# Altium project Pannel3.5x2 Ver0.1.PrjPcb
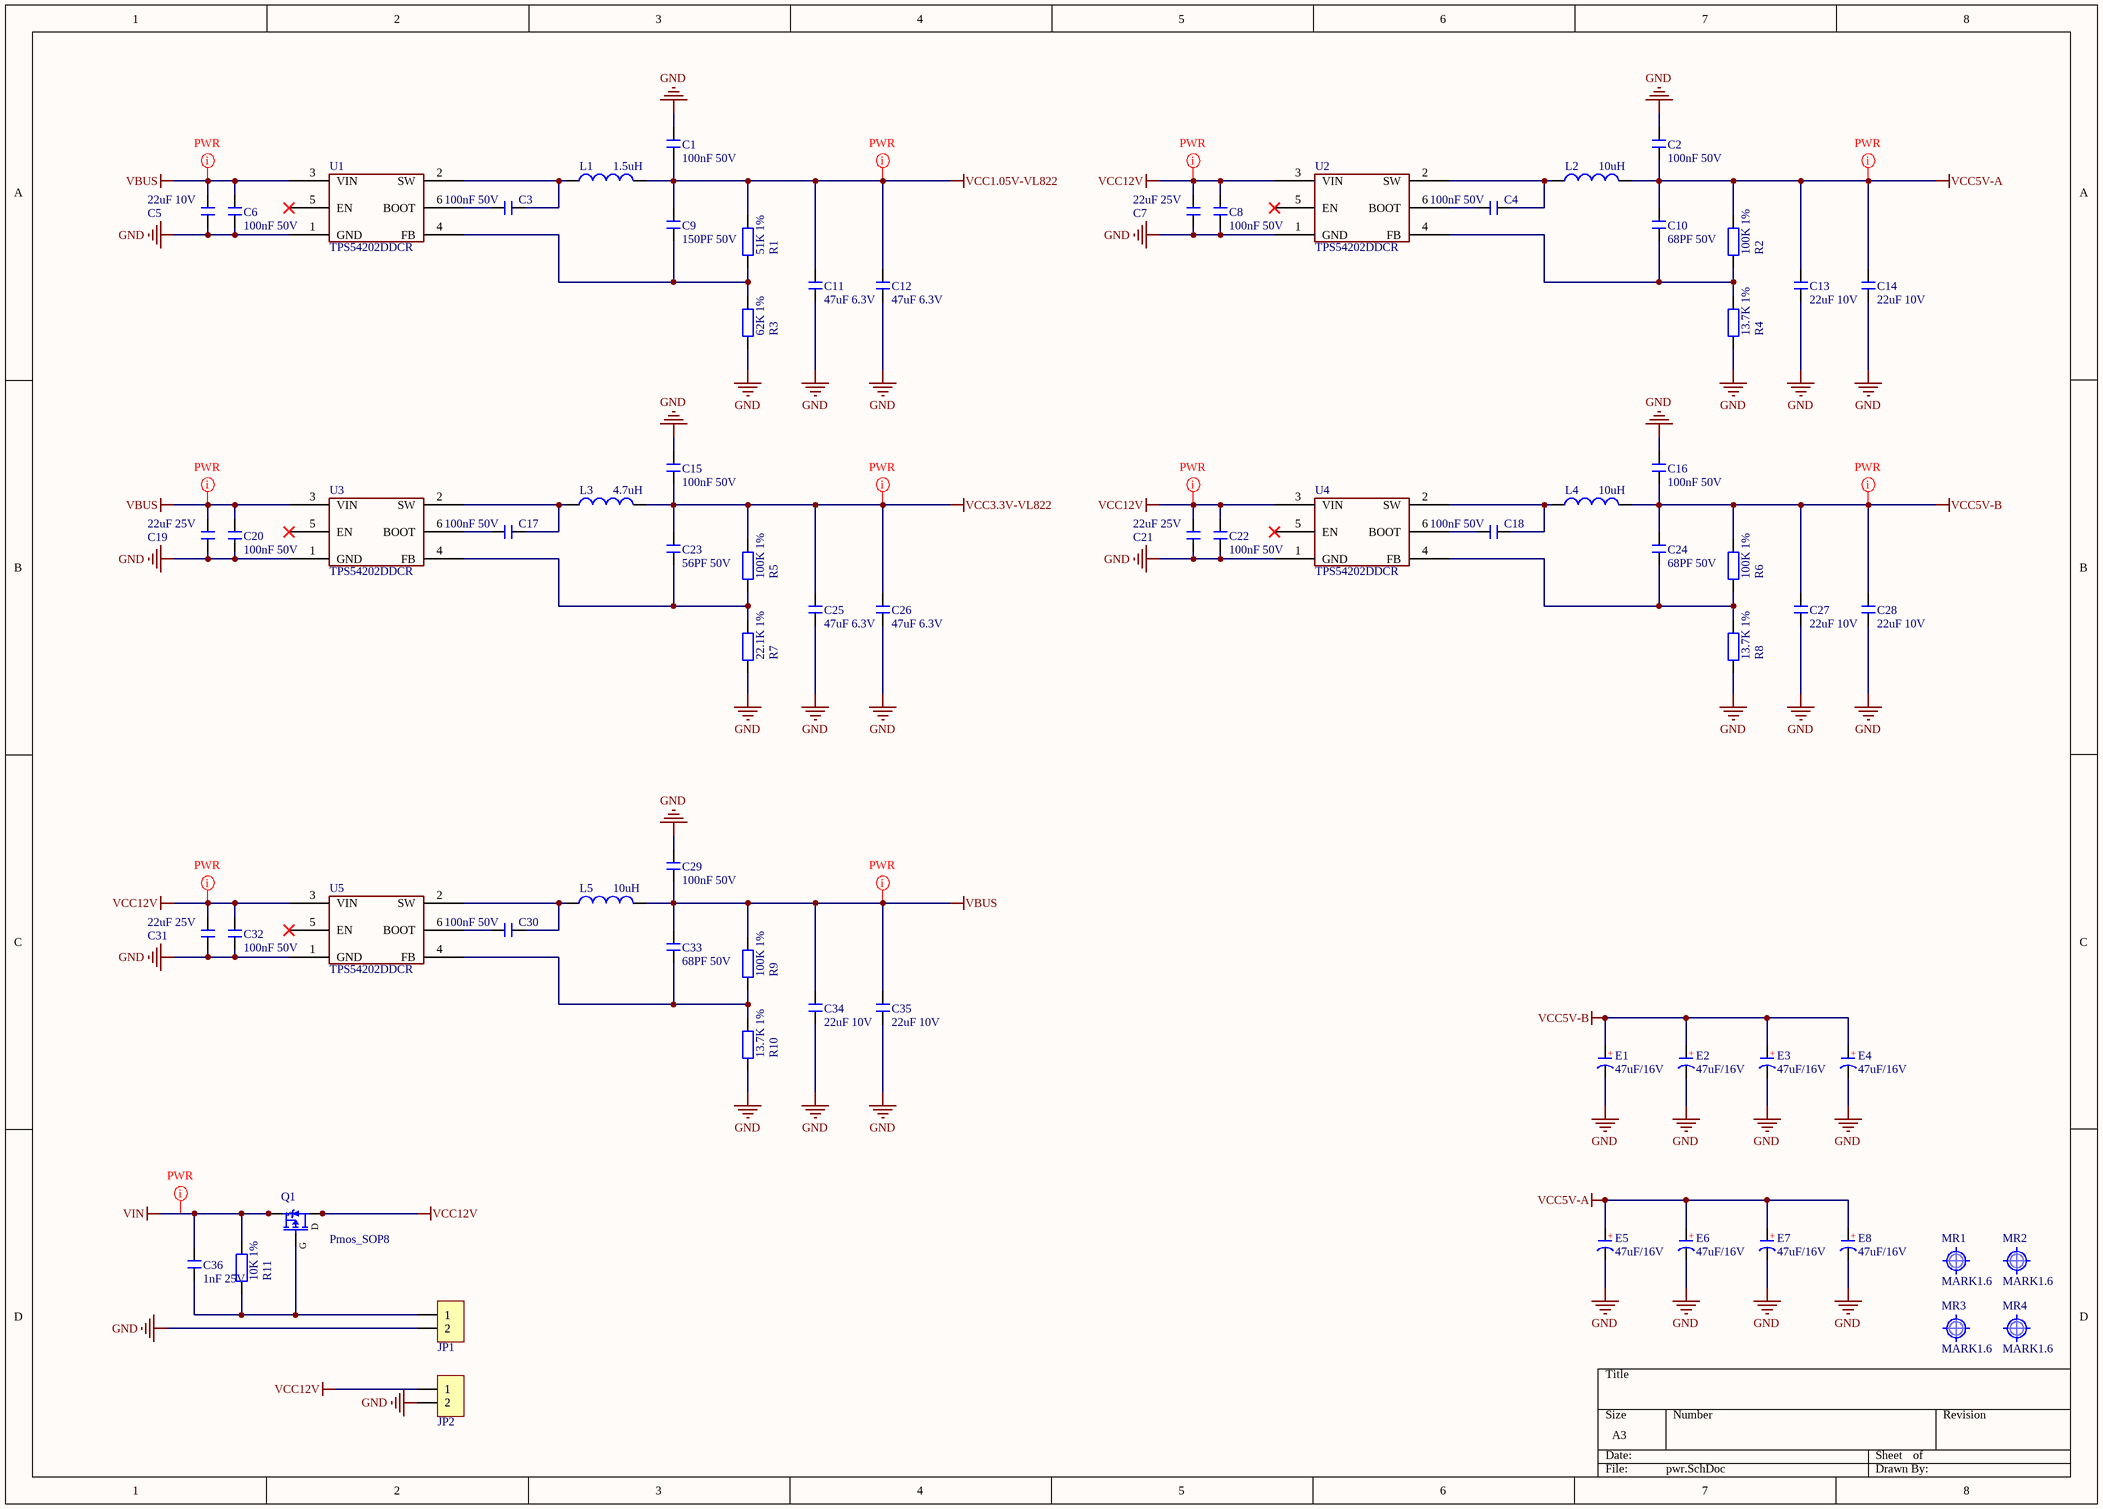
[diagram p0: pwr.SchDoc]
4 sheets, 216 parts. Net scope: global (net labels, ports and power ports of the same name join across sheets).
Board file: Pannel3.5x2 Ver0.1.PcbDoc
Sheets:
  pwr.SchDoc
  connector.SchDoc
  jmb575.SchDoc
  vl822.SchDoc

## Sheet pwr.SchDoc
size A3; SheetNumber: 1; SheetTotal: 4

### Parts
C1  100nF 50V  [C0402_L]
C2  100nF 50V  [C0402_L]
C3  100nF 50V  [C0402_L]
C4  100nF 50V  [C0402_L]
C5  22uF 10V  [C0805_L]
C6  100nF 50V  [C0402_L]
C7  22uF 25V  [C0805_L]
C8  100nF 50V  [C0402_L]
C9  150PF 50V  [C0402_L]
C10  68PF 50V  [C0402_L]
C11  47uF 6.3V  [C0805_L]
C12  47uF 6.3V  [C0805_L]
C13  22uF 10V  [C0805_L]
C14  22uF 10V  [C0805_L]
C15  100nF 50V  [C0402_L]
C16  100nF 50V  [C0402_L]
C17  100nF 50V  [C0402_L]
C18  100nF 50V  [C0402_L]
C19  22uF 25V  [C0805_L]
C20  100nF 50V  [C0402_L]
C21  22uF 25V  [C0805_L]
C22  100nF 50V  [C0402_L]
C23  56PF 50V  [C0402_L]
C24  68PF 50V  [C0402_L]
C25  47uF 6.3V  [C0805_L]
C26  47uF 6.3V  [C0805_L]
C27  22uF 10V  [C0805_L]
C28  22uF 10V  [C0805_L]
C29  100nF 50V  [C0402_L]
C30  100nF 50V  [C0402_L]
C31  22uF 25V  [C0805_L]
C32  100nF 50V  [C0402_L]
C33  68PF 50V  [C0402_L]
C34  22uF 10V  [C0805_L]
C35  22uF 10V  [C0805_L]
C36  1nF 25V  [C0402_L]
E1  47uF/16V  [CS 6*4 - R]
E2  47uF/16V  [CS 6*4 - R]
E3  47uF/16V  [CS 6*4 - R]
E4  47uF/16V  [CS 6*4 - R]
E5  47uF/16V  [CS 6*4 - R]
E6  47uF/16V  [CS 6*4 - R]
E7  47uF/16V  [CS 6*4 - R]
E8  47uF/16V  [CS 6*4 - R]
JP1  HDR-1X2  [ZH1.5-WS-2P]  (value not drawn)
JP2  HDR-1X2  [XH2.54-WS-2P]  (value not drawn)
L1  1.5uH  [SMMS0420]
L2  10uH  [SMMS0420]
L3  4.7uH  [SMMS0420]
L4  10uH  [SMMS0420]
L5  10uH  [SMMS0420]
MR1  MARK1.6  [Mark 1]
MR2  MARK1.6  [Mark 1]
MR3  MARK1.6  [Mark 1]
MR4  MARK1.6  [Mark 1]
Q1  Pmos_SOP8  [SOP8_L]
R1  51K 1%  [R0402_L]
R2  100K 1%  [R0402_L]
R3  62K 1%  [R0402_L]
R4  13.7K 1%  [R0402_L]
R5  100K 1%  [R0402_L]
R6  100K 1%  [R0402_L]
R7  22.1K 1%  [R0402_L]
R8  13.7K 1%  [R0402_L]
R9  100K 1%  [R0402_L]
R10  13.7K 1%  [R0402_L]
R11  10K 1%  [R0402_L]
U1  TPS54202DDCR  [SOT23-6L]
U2  TPS54202DDCR  [SOT23-6L]
U3  TPS54202DDCR  [SOT23-6L]
U4  TPS54202DDCR  [SOT23-6L]
U5  TPS54202DDCR  [SOT23-6L]

### Nets
GND: C1.2 C2.2 C5.1 C6.1 C7.1 C8.1 C11.2 C12.2 C13.2 C14.2 C15.2 C16.2 C19.1 C20.1 C21.1 C22.1 C25.2 C26.2 C27.2 C28.2 C29.2 C31.1 C32.1 C34.2 C35.2 E1.2(K) E2.2(K) E3.2(K) E4.2(K) E5.2(K) E6.2(K) E7.2(K) E8.2(K) JP1.2 JP2.2 R3.2 R4.2 R7.2 R8.2 R10.2 U1.1(GND) U2.1(GND) U3.1(GND) U4.1(GND) U5.1(GND)
VBUS: C5.2 C6.2 C19.2 C20.2 C29.1 C33.2 C34.1 C35.1 L5.2 R9.1 U1.3(VIN) U3.3(VIN)
VCC1.05V-VL822: C1.1 C9.2 C11.1 C12.1 L1.2 R1.1
VCC3.3V-VL822: C15.1 C23.2 C25.1 C26.1 L3.2 R5.1
VCC5V-A: C2.1 C10.2 C13.1 C14.1 E5.1(A) E6.1(A) E7.1(A) E8.1(A) L2.2 R2.1
VCC5V-B: C16.1 C24.2 C27.1 C28.1 E1.1(A) E2.1(A) E3.1(A) E4.1(A) L4.2 R6.1
VCC12V: C7.2 C8.2 C21.2 C22.2 C31.2 C32.2 JP2.1 Q1.5(D) Q1.6(D) Q1.7(D) Q1.8(D) U2.3(VIN) U4.3(VIN) U5.3(VIN)
VIN: C36.1 Q1.1(S) Q1.2(S) Q1.3(S) R11.1
NetC3_1: C3.1 U1.6(BOOT)
NetC3_2: C3.2 L1.1 U1.2(SW)
NetC4_1: C4.1 U2.6(BOOT)
NetC4_2: C4.2 L2.1 U2.2(SW)
NetC9_1: C9.1 R1.2 R3.1 U1.4(FB)
NetC10_1: C10.1 R2.2 R4.1 U2.4(FB)
NetC17_1: C17.1 U3.6(BOOT)
NetC17_2: C17.2 L3.1 U3.2(SW)
NetC18_1: C18.1 U4.6(BOOT)
NetC18_2: C18.2 L4.1 U4.2(SW)
NetC23_1: C23.1 R5.2 R7.1 U3.4(FB)
NetC24_1: C24.1 R6.2 R8.1 U4.4(FB)
NetC30_1: C30.1 U5.6(BOOT)
NetC30_2: C30.2 L5.1 U5.2(SW)
NetC33_1: C33.1 R9.2 R10.1 U5.4(FB)
NetC36_2: C36.2 JP1.1 Q1.4(G) R11.2

Not connected (* = marked no-connect by the designer): U1 5(EN)*; U2 5(EN)*; U3 5(EN)*; U4 5(EN)*; U5 5(EN)*

### Layout directives
net class PWR: VBUS, VCC1.05V-VL822, VCC3.3V-VL822, VCC5V-A, VCC5V-B, VCC12V, VIN

### Notes on the sheet
- (in symbol C-CD) +

### Library data of the parts
C1-C36 = C: 无极性贴片电容; 版权归属: 源创客; 材质: X7R; BOM名称: 无极性贴片电容; 学习资源: www.ooocke.com
E1-E8 = C-CD: 贴片电解电容; BOM名称: 贴片钽电容; 版权归属: 源创客; 学习资源: www.ooocke.com
JP1 JP2 = Header 2: 2P接插件; 版权归属: 源创客; BOM名称: 2P接插件; 学习资源: www.ooocke.com
L1-L5 = L: 小功率贴片电感; 版权归属: 源创客; BOM名称: 小功率贴片电感; 学习资源: www.ooocke.com
MR1-MR4 = MARK: 光学定位点; 版权归属: 源创客; BOM名称: 光学定位点; 学习资源: www.ooocke.com
Q1 = Pmos_SOP8: BOM名称: 场效应管; 版权归属: 源创客; 描述: P沟道 30V/4.2A; 学习资源: www.ooocke.com
R1-R11 = R: 贴片电阻; 版权归属: 源创客; BOM名称: 贴片电阻; 学习资源: www.ooocke.com
U1-U5 = TPS54202DDCR: DCDC Convert

## Sheet connector.SchDoc
size A4; SheetNumber: 2; SheetTotal: 4
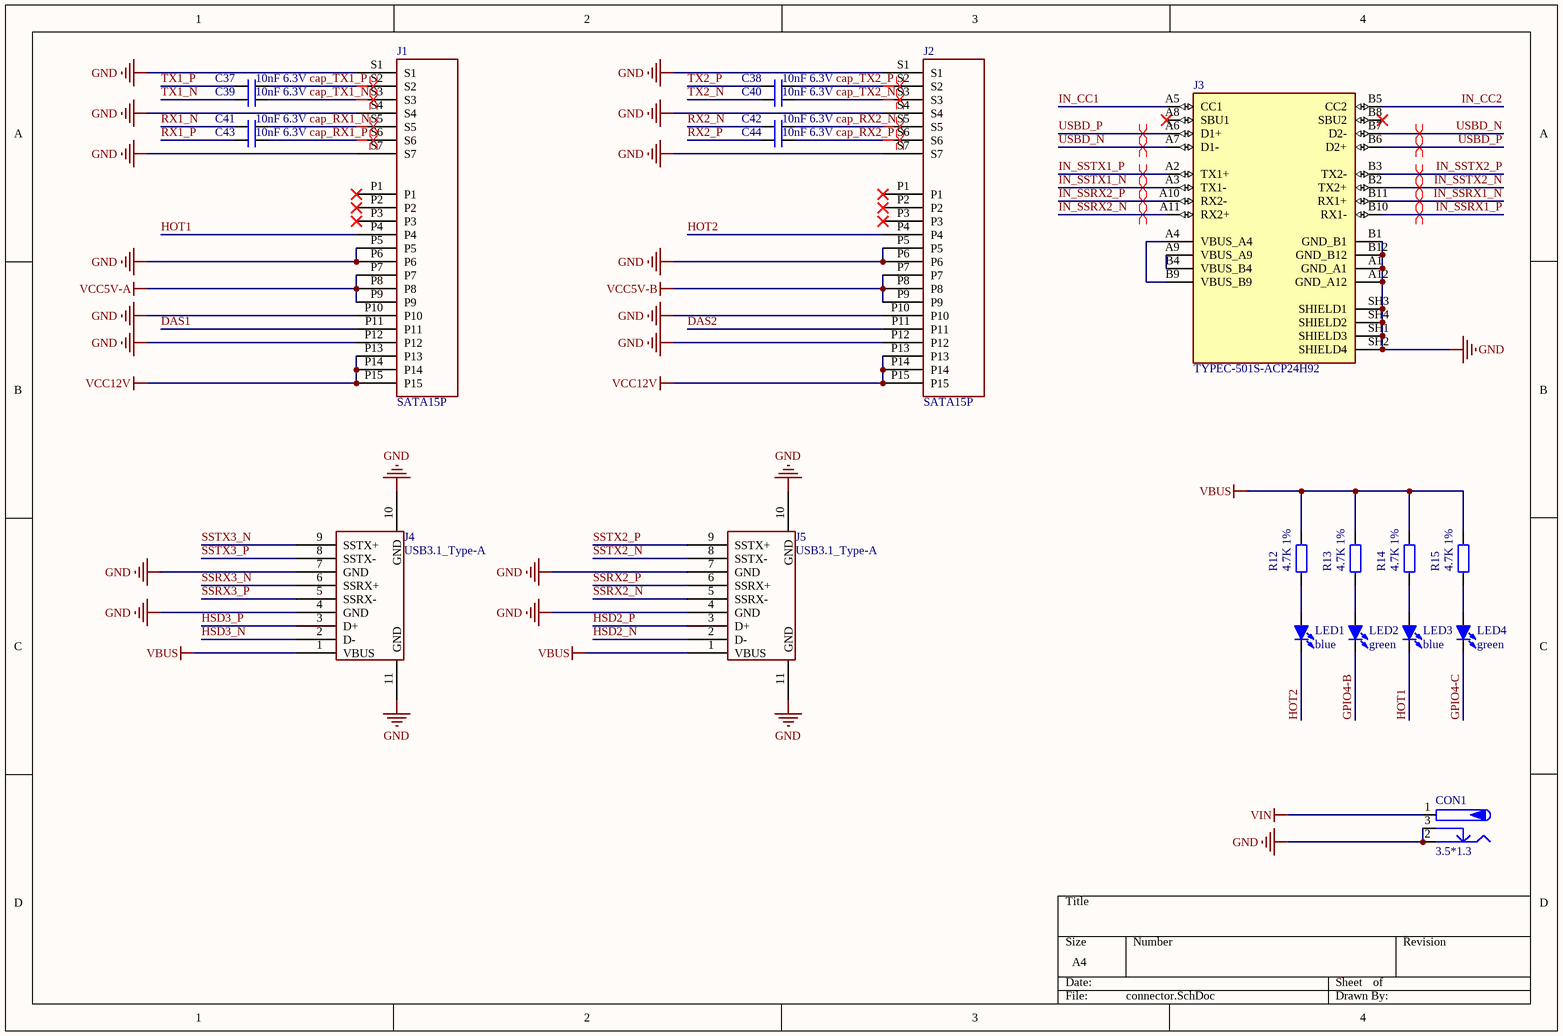
[diagram p1: connector.SchDoc]

### Parts
C37  10nF 6.3V  [C0402_L]
C38  10nF 6.3V  [C0402_L]
C39  10nF 6.3V  [C0402_L]
C40  10nF 6.3V  [C0402_L]
C41  10nF 6.3V  [C0402_L]
C42  10nF 6.3V  [C0402_L]
C43  10nF 6.3V  [C0402_L]
C44  10nF 6.3V  [C0402_L]
CON1  3.5*1.3  [DC-IN-SMD_DC-182-25A]
J1  SATA15P  [SATA 15P 贴片]
J2  SATA15P  [SATA 15P 贴片]
J3  TYPEC-501S-ACP24H92  [TypeC 24p 直立]
J4  USB3.1_Type-A  [USB3.1_Type-A 立式直插]
J5  USB3.1_Type-A  [USB3.1_Type-A 立式直插]
LED1  blue  [LED 0805B]
LED2  green  [LED 0805G]
LED3  blue  [LED 0805B]
LED4  green  [LED 0805G]
R12  4.7K 1%  [R0402_L]
R13  4.7K 1%  [R0402_L]
R14  4.7K 1%  [R0402_L]
R15  4.7K 1%  [R0402_L]

### Nets
GND: CON1.2 CON1.3 J1.P5 J1.P6 J1.P10 J1.P12 J1.S1 J1.S4 J1.S7 J2.P5 J2.P6 J2.P10 J2.P12 J2.S1 J2.S4 J2.S7 J3.A1(GND_A1) J3.A12(GND_A12) J3.B1(GND_B1) J3.B12(GND_B12) J3.SH1(SHIELD3) J3.SH2(SHIELD4) J3.SH3(SHIELD1) J3.SH4(SHIELD2) J4.4(GND) J4.7(GND) J4.10(GND) J4.11(GND) J5.4(GND) J5.7(GND) J5.10(GND) J5.11(GND)
VBUS: J4.1(VBUS) J5.1(VBUS) R12.1 R13.1 R14.1 R15.1
VCC5V-A: J1.P7 J1.P8 J1.P9
VCC5V-B: J2.P7 J2.P8 J2.P9
VCC12V: J1.P13 J1.P14 J1.P15 J2.P13 J2.P14 J2.P15
VIN: CON1.1
cap_RX1_N: C41.1 J1.S5
cap_RX1_P: C43.1 J1.S6
cap_RX2_N: C42.1 J2.S5
cap_RX2_P: C44.1 J2.S6
cap_TX1_N: C39.1 J1.S3
cap_TX1_P: C37.1 J1.S2
cap_TX2_N: C40.1 J2.S3
cap_TX2_P: C38.1 J2.S2
DAS1: J1.P11
DAS2: J2.P11
GPIO4-B: LED2.2(K)
GPIO4-C: LED4.2(K)
HOT1: J1.P4 LED3.2(K)
HOT2: J2.P4 LED1.2(K)
HSD2_N: J5.2(D-)
HSD2_P: J5.3(D+)
HSD3_N: J4.2(D-)
HSD3_P: J4.3(D+)
IN_CC1: J3.A5(CC1)
IN_CC2: J3.B5(CC2)
IN_SSRX1_N: J3.B11(RX1+)
IN_SSRX1_P: J3.B10(RX1-)
IN_SSRX2_N: J3.A11(RX2+)
IN_SSRX2_P: J3.A10(RX2-)
IN_SSTX1_N: J3.A3(TX1-)
IN_SSTX1_P: J3.A2(TX1+)
IN_SSTX2_N: J3.B2(TX2+)
IN_SSTX2_P: J3.B3(TX2-)
RX1_N: C41.2
RX1_P: C43.2
RX2_N: C42.2
RX2_P: C44.2
SSRX2_N: J5.5(SSRX-)
SSRX2_P: J5.6(SSRX+)
SSRX3_N: J4.6(SSRX+)
SSRX3_P: J4.5(SSRX-)
SSTX2_N: J5.8(SSTX-)
SSTX2_P: J5.9(SSTX+)
SSTX3_N: J4.9(SSTX+)
SSTX3_P: J4.8(SSTX-)
TX1_N: C39.2
TX1_P: C37.2
TX2_N: C40.2
TX2_P: C38.2
USBD_N: J3.A7(D1-) J3.B7(D2-)
USBD_P: J3.A6(D1+) J3.B6(D2+)
NetJ3_A4: J3.A4(VBUS_A4) J3.B9(VBUS_B9)
NetJ3_A9: J3.A9(VBUS_A9) J3.B4(VBUS_B4)
NetLED1_1: LED1.1(A) R12.2
NetLED2_1: LED2.1(A) R13.2
NetLED3_1: LED3.1(A) R14.2
NetLED4_1: LED4.1(A) R15.2

Not connected (* = marked no-connect by the designer): J1 P1* P2* P3*; J2 P1* P2* P3*; J3 A8(SBU1)* B8(SBU2)*

### Layout directives
differential pair: cap_RX1_N, cap_RX1_P, cap_RX2_N, cap_RX2_P, cap_TX1_N, cap_TX1_P, cap_TX2_N, cap_TX2_P, IN_SSRX1_N, IN_SSRX1_P, IN_SSRX2_N, IN_SSRX2_P, IN_SSTX1_N, IN_SSTX1_P, IN_SSTX2_N, IN_SSTX2_P, USBD_N, USBD_P

### Library data of the parts
C37-C44 = C: 无极性贴片电容; 版权归属: 源创客; 材质: X7R; BOM名称: 无极性贴片电容; 学习资源: www.ooocke.com
CON1 = P-DC: 低压电源接口; BOM名称: DC电源接口; 版权归属: 源创客; 学习资源: www.ooocke.com
J3 = Typec 24p: USB-C (USB TYPE-C) USB 3.2 Gen 2 (USB 3.1 Gen 2, Superspeed + (USB 3.1)) Receptacle Connector 24 Position Surface Mount, Right Angle; Through Hole; MF: Molex; MP: 1054500101; SnapEDA_Link: https://www.snapeda.com/parts/1054500101/Molex/view-part/?ref=snap; Package: None; Value: *; Check_prices: https://www.snapeda.com/parts/1054500101/Molex/view-part/?ref=eda
J4 J5 = USB3.1_Type-A: USB接口
LED1-LED4 = LED-3MM: 插件LED; 版权归属: 源创客; BOM名称: 插件LED; 学习资源: www.ooocke.com
R12-R15 = R: 贴片电阻; 版权归属: 源创客; BOM名称: 贴片电阻; 学习资源: www.ooocke.com

## Sheet jmb575.SchDoc
size A2; SheetNumber: 3; SheetTotal: 4
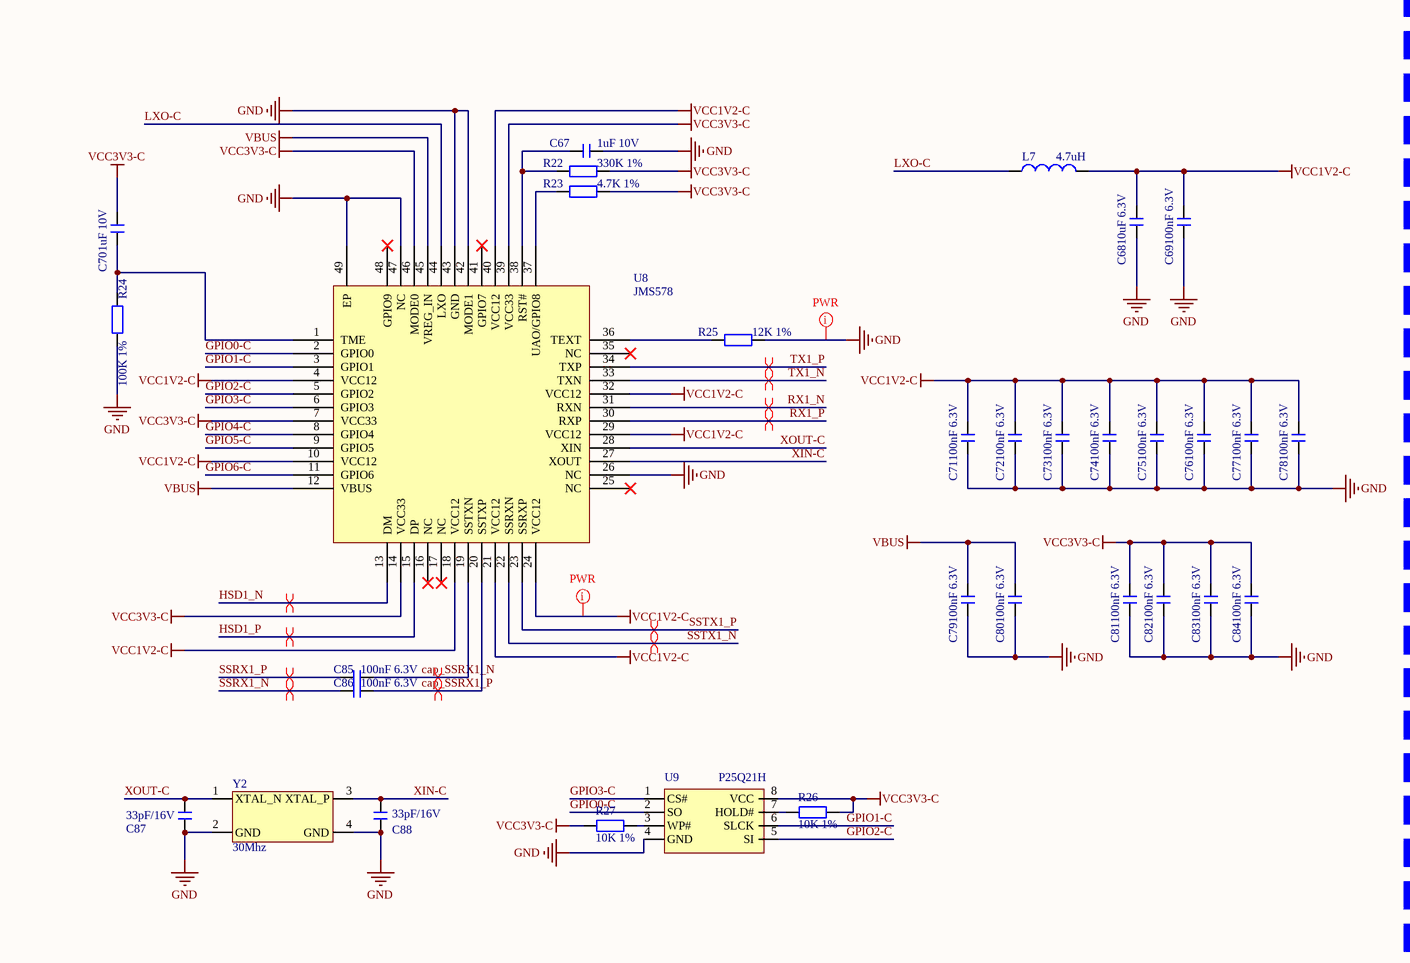
[diagram p2: jmb575.SchDoc, left]
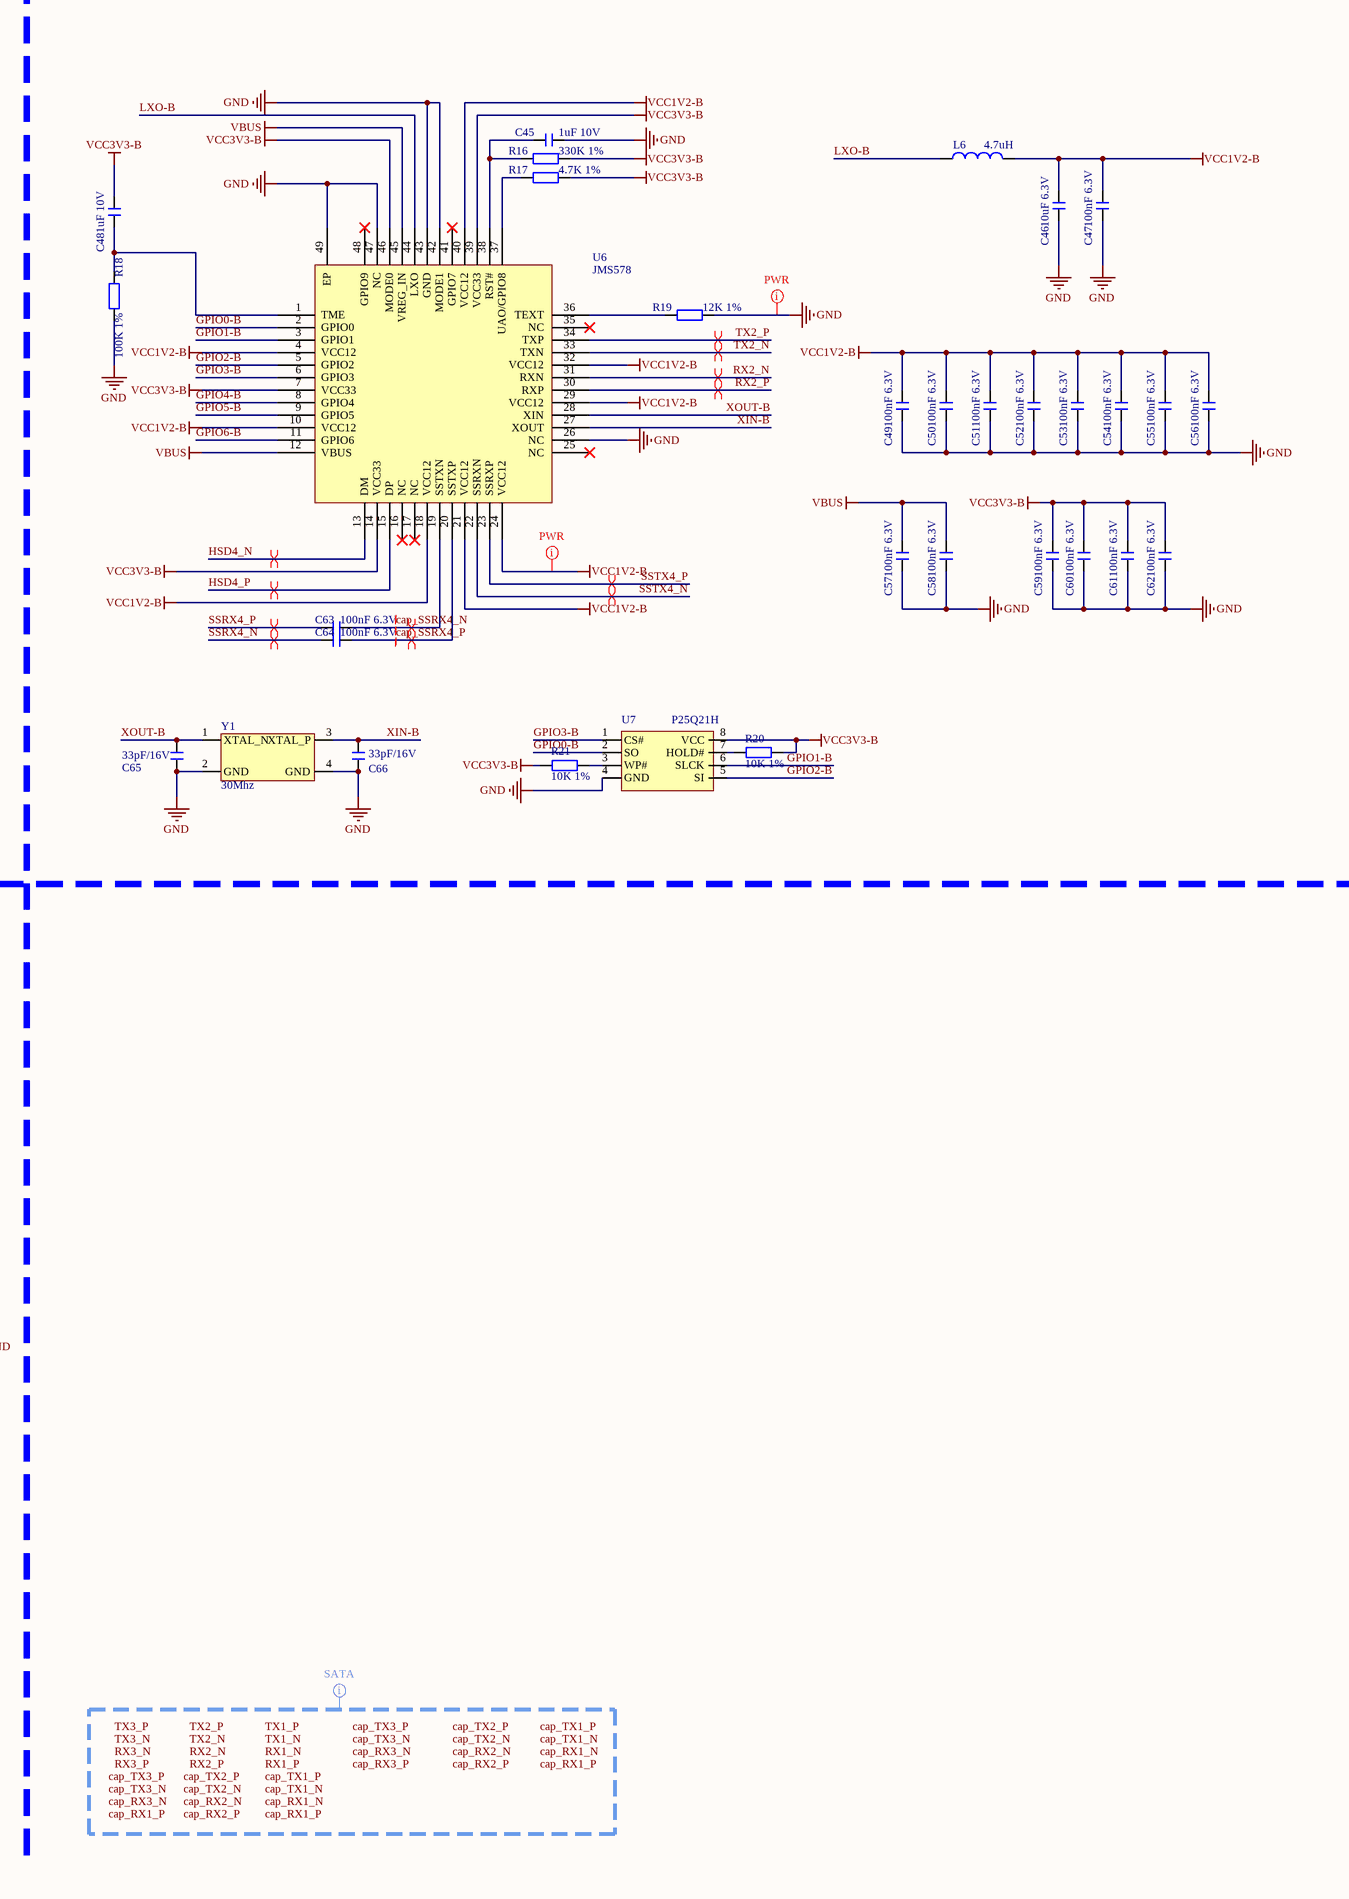
[diagram p3: jmb575.SchDoc, right]

### Parts
C45  1uF 10V  [C0402_L]
C46  10uF 6.3V  [C0603_L]
C47  100nF 6.3V  [C0402_L]
C48  1uF 10V  [C0402_L]
C49  100nF 6.3V  [C0402_L]
C50  100nF 6.3V  [C0402_L]
C51  100nF 6.3V  [C0402_L]
C52  100nF 6.3V  [C0402_L]
C53  100nF 6.3V  [C0402_L]
C54  100nF 6.3V  [C0402_L]
C55  100nF 6.3V  [C0402_L]
C56  100nF 6.3V  [C0402_L]
C57  100nF 6.3V  [C0402_L]
C58  100nF 6.3V  [C0402_L]
C59  100nF 6.3V  [C0402_L]
C60  100nF 6.3V  [C0402_L]
C61  100nF 6.3V  [C0402_L]
C62  100nF 6.3V  [C0402_L]
C63  100nF 6.3V  [C0402_L]
C64  100nF 6.3V  [C0402_L]
C65  33pF/16V  [C0402_L]
C66  33pF/16V  [C0402_L]
C67  1uF 10V  [C0402_L]
C68  10uF 6.3V  [C0603_L]
C69  100nF 6.3V  [C0402_L]
C70  1uF 10V  [C0402_L]
C71  100nF 6.3V  [C0402_L]
C72  100nF 6.3V  [C0402_L]
C73  100nF 6.3V  [C0402_L]
C74  100nF 6.3V  [C0402_L]
C75  100nF 6.3V  [C0402_L]
C76  100nF 6.3V  [C0402_L]
C77  100nF 6.3V  [C0402_L]
C78  100nF 6.3V  [C0402_L]
C79  100nF 6.3V  [C0402_L]
C80  100nF 6.3V  [C0402_L]
C81  100nF 6.3V  [C0402_L]
C82  100nF 6.3V  [C0402_L]
C83  100nF 6.3V  [C0402_L]
C84  100nF 6.3V  [C0402_L]
C85  100nF 6.3V  [C0402_L]
C86  100nF 6.3V  [C0402_L]
C87  33pF/16V  [C0402_L]
C88  33pF/16V  [C0402_L]
L6  4.7uH  [SMMS0420]
L7  4.7uH  [SMMS0420]
R16  330K 1%  [R0402_L]
R17  4.7K 1%  [R0402_L]
R18  100K 1%  [R0402_L]
R19  12K 1%  [R0402_L]
R20  10K 1%  [R0402_L]
R21  10K 1%  [R0402_L]
R22  330K 1%  [R0402_L]
R23  4.7K 1%  [R0402_L]
R24  100K 1%  [R0402_L]
R25  12K 1%  [R0402_L]
R26  10K 1%  [R0402_L]
R27  10K 1%  [R0402_L]
U6  JMS578  [QFN48-L6.0-W6.0-P0.4]
U7  P25Q21H  [SOP8_L]
U8  JMS578  [QFN48-L6.0-W6.0-P0.4]
U9  P25Q21H  [SOP8_L]
Y1  30Mhz  [OSC 3225-4P]
Y2  30Mhz  [OSC 3225-4P]

### Nets
GND: C45.1 C46.1 C47.1 C49.1 C50.1 C51.1 C52.1 C53.1 C54.1 C55.1 C56.1 C57.1 C58.1 C59.1 C60.1 C61.1 C62.1 C65.2 C66.2 C67.1 C68.1 C69.1 C71.1 C72.1 C73.1 C74.1 C75.1 C76.1 C77.1 C78.1 C79.1 C80.1 C81.1 C82.1 C83.1 C84.1 C87.2 C88.2 R18.1 R19.1 R24.1 R25.1 U6.26(NC) U6.42(MODE1) U6.43(GND) U6.47(NC) U6.49(EP) U7.4(GND) U8.26(NC) U8.42(MODE1) U8.43(GND) U8.47(NC) U8.49(EP) U9.4(GND) Y1.2(GND) Y1.4(GND) Y2.2(GND) Y2.4(GND)
VBUS: C57.2 C58.2 C79.2 C80.2 U6.12(VBUS) U6.45(VREG_IN) U8.12(VBUS) U8.45(VREG_IN)
VCC1V2-B: C46.2 C47.2 C49.2 C50.2 C51.2 C52.2 C53.2 C54.2 C55.2 C56.2 L6.2 U6.4(VCC12) U6.10(VCC12) U6.18(VCC12) U6.21(VCC12) U6.24(VCC12) U6.29(VCC12) U6.32(VCC12) U6.40(VCC12)
VCC1V2-C: C68.2 C69.2 C71.2 C72.2 C73.2 C74.2 C75.2 C76.2 C77.2 C78.2 L7.2 U8.4(VCC12) U8.10(VCC12) U8.18(VCC12) U8.21(VCC12) U8.24(VCC12) U8.29(VCC12) U8.32(VCC12) U8.40(VCC12)
VCC3V3-B: C48.2 C59.2 C60.2 C61.2 C62.2 R16.1 R17.1 R20.1 R21.1 U6.7(VCC33) U6.14(VCC33) U6.39(VCC33) U6.46(MODE0) U7.8(VCC)
VCC3V3-C: C70.2 C81.2 C82.2 C83.2 C84.2 R22.1 R23.1 R26.1 R27.2 U8.7(VCC33) U8.14(VCC33) U8.39(VCC33) U8.46(MODE0) U9.8(VCC)
cap_SSRX1_N: C85.2 U8.19(SSTXN)
cap_SSRX1_P: C86.2 U8.20(SSTXP)
cap_SSRX4_N: C63.2 U6.19(SSTXN)
cap_SSRX4_P: C64.2 U6.20(SSTXP)
GPIO0-B: U6.2(GPIO0) U7.2(SO)
GPIO0-C: U8.2(GPIO0) U9.2(SO)
GPIO1-B: U6.3(GPIO1) U7.6(SLCK)
GPIO1-C: U8.3(GPIO1) U9.6(SLCK)
GPIO2-B: U6.5(GPIO2) U7.5(SI)
GPIO2-C: U8.5(GPIO2) U9.5(SI)
GPIO3-B: U6.6(GPIO3) U7.1(CS#)
GPIO3-C: U8.6(GPIO3) U9.1(CS#)
GPIO4-B: U6.8(GPIO4)
GPIO4-C: U8.8(GPIO4)
GPIO5-B: U6.9(GPIO5)
GPIO5-C: U8.9(GPIO5)
GPIO6-B: U6.11(GPIO6)
GPIO6-C: U8.11(GPIO6)
HSD1_N: U8.13(DM)
HSD1_P: U8.15(DP)
HSD4_N: U6.13(DM)
HSD4_P: U6.15(DP)
LXO-B: L6.1 U6.44(LXO)
LXO-C: L7.1 U8.44(LXO)
RX1_N: U8.31(RXN)
RX1_P: U8.30(RXP)
RX2_N: U6.31(RXN)
RX2_P: U6.30(RXP)
SSRX1_N: C86.1
SSRX1_P: C85.1
SSRX4_N: C64.1
SSRX4_P: C63.1
SSTX1_N: U8.22(SSRXN)
SSTX1_P: U8.23(SSRXP)
SSTX4_N: U6.22(SSRXN)
SSTX4_P: U6.23(SSRXP)
TX1_N: U8.33(TXN)
TX1_P: U8.34(TXP)
TX2_N: U6.33(TXN)
TX2_P: U6.34(TXP)
XIN-B: C66.1 U6.27(XOUT) Y1.3(XTAL_P)
XIN-C: C88.1 U8.27(XOUT) Y2.3(XTAL_P)
XOUT-B: C65.1 U6.28(XIN) Y1.1(XTAL_N)
XOUT-C: C87.1 U8.28(XIN) Y2.1(XTAL_N)
NetC45_2: C45.2 R16.2 U6.38(RST#)
NetC48_1: C48.1 R18.2 U6.1(TME)
NetC67_2: C67.2 R22.2 U8.38(RST#)
NetC70_1: C70.1 R24.2 U8.1(TME)
NetR17_2: R17.2 U6.37(UAO/GPIO8)
NetR19_2: R19.2 U6.36(TEXT)
NetR20_2: R20.2 U7.7(HOLD#)
NetR21_2: R21.2 U7.3(WP#)
NetR23_2: R23.2 U8.37(UAO/GPIO8)
NetR25_2: R25.2 U8.36(TEXT)
NetR26_2: R26.2 U9.7(HOLD#)
NetR27_1: R27.1 U9.3(WP#)

Not connected (* = marked no-connect by the designer): U6 16(NC)* 17(NC)* 25(NC)* 35(NC)* 41(GPIO7)* 48(GPIO9)*; U8 16(NC)* 17(NC)* 25(NC)* 35(NC)* 41(GPIO7)* 48(GPIO9)*

### Layout directives
differential pair: cap_SSRX1_N, cap_SSRX1_P, cap_SSRX4_N, cap_SSRX4_P, HSD1_N, HSD1_P, HSD4_N, HSD4_P, RX1_N, RX1_P, RX2_N, RX2_P, SSRX1_N, SSRX1_P, SSRX4_N, SSRX4_P, SSTX1_N, SSTX1_P, SSTX4_N, SSTX4_P, TX1_N, TX1_P, TX2_N, TX2_P
net class PWR: GND, VCC1V2-B, VCC1V2-C
net class SATA; rule Differential Pairs Routing [Pref Gap = 6mil    Min Gap  = 6mil    Max Gap  = 6milPref Width = 4.29mil    Min Width  = 4.29mil    Max Width  = 4.29mil]; rule Routing Via Style [Pref Size = 0.4mm    Pref Hole Size = 0.3mm]: cap_RX1_N, cap_RX1_P, cap_RX2_N, cap_RX2_P, cap_RX3_N, cap_RX3_P, cap_TX1_N, cap_TX1_P, cap_TX2_N, cap_TX2_P, cap_TX3_N, cap_TX3_P, RX1_N, RX1_P, RX2_N, RX2_P, RX3_N, RX3_P, TX1_N, TX1_P, TX2_N, TX2_P, TX3_N, TX3_P

### Notes on the sheet
- Labels drawn without touching a wire or pin: cap_RX1_N, cap_RX1_P, cap_RX2_N, cap_RX2_P, cap_RX3_N, cap_RX3_P, cap_TX1_N, cap_TX1_P, cap_TX2_N, cap_TX2_P, cap_TX3_N, cap_TX3_P, RX1_N, RX1_P, RX2_N, RX2_P, RX3_N, RX3_P, TX1_N, TX1_P, TX2_N, TX2_P, TX3_N, TX3_P

### Library data of the parts
C45-C88 = C: 无极性贴片电容; 版权归属: 源创客; 材质: X7R; BOM名称: 无极性贴片电容; 学习资源: www.ooocke.com
L6 L7 = L: 小功率贴片电感; 版权归属: 源创客; BOM名称: 小功率贴片电感; 学习资源: www.ooocke.com
R16-R27 = R: 贴片电阻; 版权归属: 源创客; BOM名称: 贴片电阻; 学习资源: www.ooocke.com
U7 U9 = P25D40H
Y1 Y2 = Crystal

## Sheet vl822.SchDoc
size A3; SheetNumber: 4; SheetTotal: 4
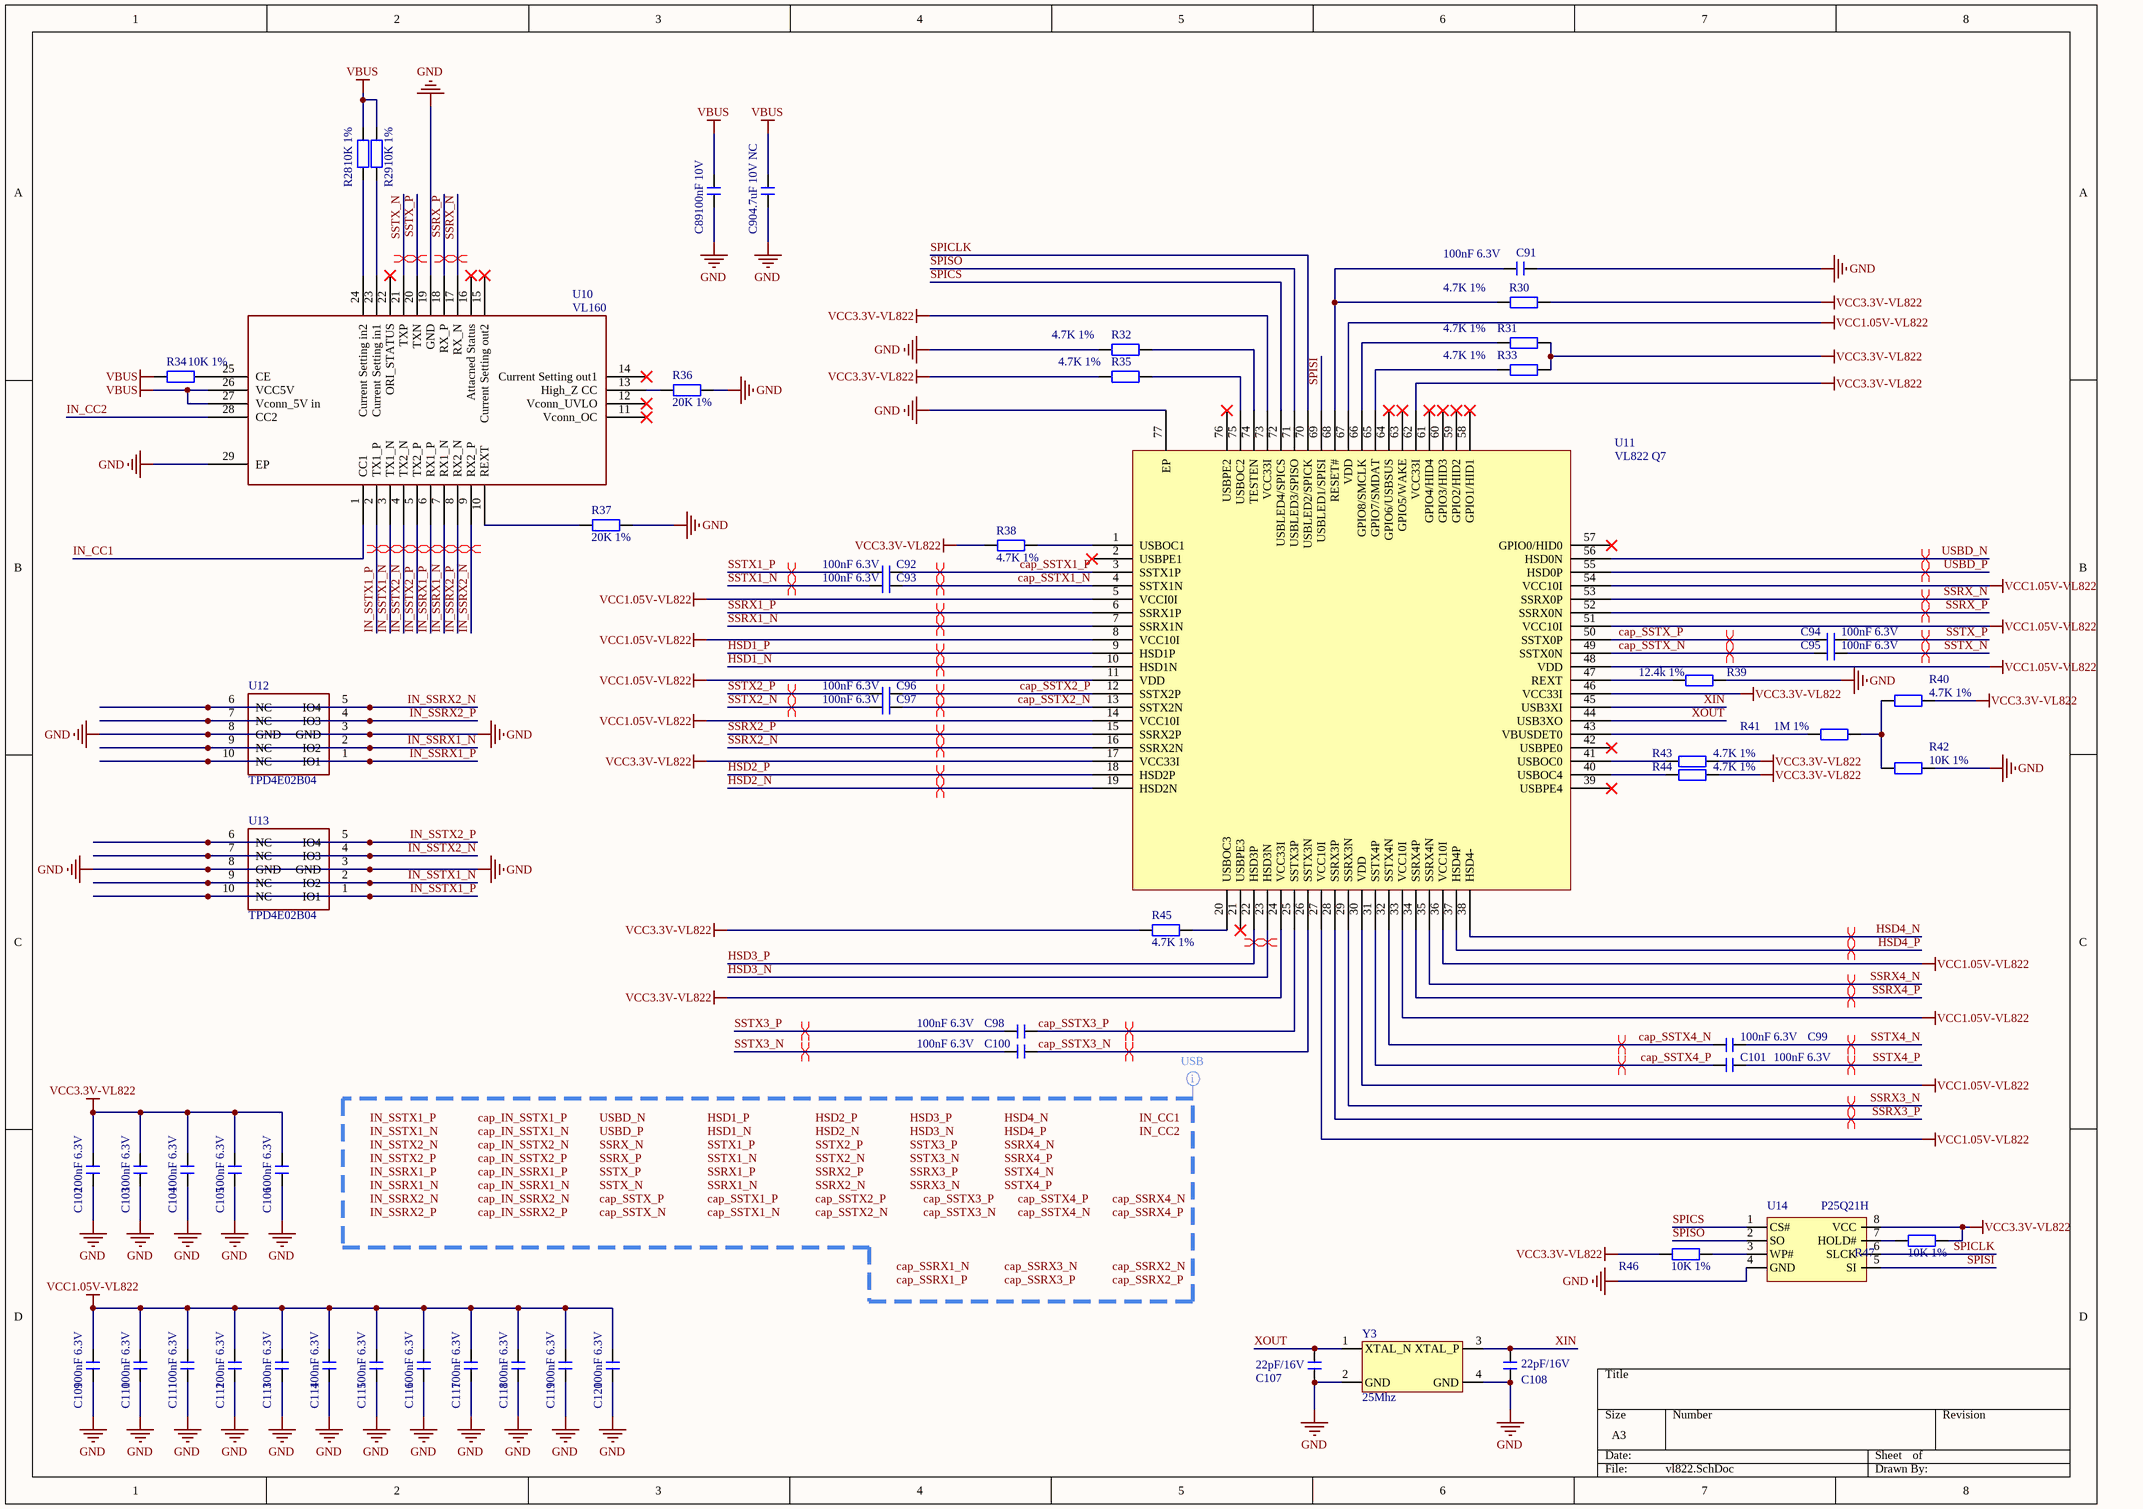
[diagram p4: vl822.SchDoc]

### Parts
C89  100nF 10V  [C0402_L]
C90  4.7uF 10V NC  [C0402_L]
C91  100nF 6.3V  [C0402_L]
C92  100nF 6.3V  [C0402_L]
C93  100nF 6.3V  [C0402_L]
C94  100nF 6.3V  [C0402_L]
C95  100nF 6.3V  [C0402_L]
C96  100nF 6.3V  [C0402_L]
C97  100nF 6.3V  [C0402_L]
C98  100nF 6.3V  [C0402_L]
C99  100nF 6.3V  [C0402_L]
C100  100nF 6.3V  [C0402_L]
C101  100nF 6.3V  [C0402_L]
C102  100nF 6.3V  [C0402_L]
C103  100nF 6.3V  [C0402_L]
C104  100nF 6.3V  [C0402_L]
C105  100nF 6.3V  [C0402_L]
C106  100nF 6.3V  [C0402_L]
C107  22pF/16V  [C0402_L]
C108  22pF/16V  [C0402_L]
C109  100nF 6.3V  [C0402_L]
C110  100nF 6.3V  [C0402_L]
C111  100nF 6.3V  [C0402_L]
C112  100nF 6.3V  [C0402_L]
C113  100nF 6.3V  [C0402_L]
C114  100nF 6.3V  [C0402_L]
C115  100nF 6.3V  [C0402_L]
C116  100nF 6.3V  [C0402_L]
C117  100nF 6.3V  [C0402_L]
C118  100nF 6.3V  [C0402_L]
C119  100nF 6.3V  [C0402_L]
C120  100nF 6.3V  [C0402_L]
R28  10K 1%  [R0402_L]
R29  10K 1%  [R0402_L]
R30  4.7K 1%  [R0402_L]
R31  4.7K 1%  [R0402_L]
R32  4.7K 1%  [R0402_L]
R33  4.7K 1%  [R0402_L]
R34  10K 1%  [R0402_L]
R35  4.7K 1%  [R0402_L]
R36  20K 1%  [R0402_L]
R37  20K 1%  [R0402_L]
R38  4.7K 1%  [R0402_L]
R39  12.4k 1%  [R0402_L]
R40  4.7K 1%  [R0402_L]
R41  1M 1%  [R0402_L]
R42  10K 1%  [R0402_L]
R43  4.7K 1%  [R0402_L]
R44  4.7K 1%  [R0402_L]
R45  4.7K 1%  [R0402_L]
R46  10K 1%  [R0402_L]
R47  10K 1%  [R0402_L]
U10  VL160  [MQFN-28_L4.5-W3.5-P0.40-BL-EP]
U11  VL822 Q7  [QFN-76_L9.0-W9.0-P0.40-EP6.3-TL]
U12  TPD4E02B04  [DIO_TPD4E02B04DQAR]
U13  TPD4E02B04  [DIO_TPD4E02B04DQAR]
U14  P25Q21H  [SOP8_L]
Y3  25Mhz  [OSC 3225-4P]

### Nets
GND: C89.1 C90.1 C91.2 C102.1 C103.1 C104.1 C105.1 C106.1 C107.2 C108.2 C109.1 C110.1 C111.1 C112.1 C113.1 C114.1 C115.1 C116.1 C117.1 C118.1 C119.1 C120.1 R32.2 R36.1 R37.1 R39.2 R42.2 U10.19(GND) U10.29(EP) U11.77(EP) U12.3(GND) U12.8(GND) U13.3(GND) U13.8(GND) U14.4(GND) Y3.2(GND) Y3.4(GND)
VBUS: C89.2 C90.2 R28.1 R29.1 R34.2 U10.26(VCC5V) U10.27(Vconn_5V_in)
VCC1.05V-VL822: C109.2 C110.2 C111.2 C112.2 C113.2 C114.2 C115.2 C116.2 C117.2 C118.2 C119.2 C120.2 U11.5(VCCI0I) U11.8(VCC10I) U11.11(VDD) U11.14(VCC10I) U11.27(VCC10I) U11.30(VDD) U11.33(VCC10I) U11.36(VCC10I) U11.48(VDD) U11.51(VCC10I) U11.54(VCC10I) U11.67(VDD)
VCC3.3V-VL822: C102.2 C103.2 C104.2 C105.2 C106.2 R30.2 R31.2 R33.2 R35.2 R38.2 R40.2 R43.2 R44.2 R45.2 R46.2 R47.1 U11.17(VCC33I) U11.24(VCC33I) U11.46(VCC33I) U11.62(VCC33I) U11.73(VCC33I) U14.8(VCC)
cap_SSTX1_N: C93.2 U11.4(SSTX1N)
cap_SSTX1_P: C92.2 U11.3(SSTX1P)
cap_SSTX2_N: C97.2 U11.13(SSTX2N)
cap_SSTX2_P: C96.2 U11.12(SSTX2P)
cap_SSTX3_N: C100.2 U11.26(SSTX3N)
cap_SSTX3_P: C98.2 U11.25(SSTX3P)
cap_SSTX4_N: C99.2 U11.32(SSTX4N)
cap_SSTX4_P: C101.2 U11.31(SSTX4P)
cap_SSTX_N: C95.2 U11.49(SSTX0N)
cap_SSTX_P: C94.2 U11.50(SSTX0P)
HSD1_N: U11.10(HSD1N)
HSD1_P: U11.9(HSD1P)
HSD2_N: U11.19(HSD2N)
HSD2_P: U11.18(HSD2P)
HSD3_N: U11.23(HSD3N)
HSD3_P: U11.22(HSD3P)
HSD4_N: U11.38(HSD4-)
HSD4_P: U11.37(HSD4P)
IN_CC1: U10.1(CC1)
IN_CC2: U10.28(CC2)
IN_SSRX1_N: U10.7(RX1_N) U12.2(IO2) U12.9(NC)
IN_SSRX1_P: U10.6(RX1_P) U12.1(IO1) U12.10(NC)
IN_SSRX2_N: U10.9(RX2_P) U12.5(IO4) U12.6(NC)
IN_SSRX2_P: U10.8(RX2_N) U12.4(IO3) U12.7(NC)
IN_SSTX1_N: U10.3(TX1_N) U13.2(IO2) U13.9(NC)
IN_SSTX1_P: U10.2(TX1_P) U13.1(IO1) U13.10(NC)
IN_SSTX2_N: U10.4(TX2_N) U13.4(IO3) U13.7(NC)
IN_SSTX2_P: U10.5(TX2_P) U13.5(IO4) U13.6(NC)
SPICLK: U11.70(USBLED2/SPICK) U14.6(SLCK)
SPICS: U11.72(USBLED4/SPICS) U14.1(CS#)
SPISI: U11.69(USBLED1/SPISI) U14.5(SI)
SPISO: U11.71(USBLED3/SPISO) U14.2(SO)
SSRX1_N: U11.7(SSRX1N)
SSRX1_P: U11.6(SSRX1P)
SSRX2_N: U11.16(SSRX2N)
SSRX2_P: U11.15(SSRX2P)
SSRX3_N: U11.29(SSRX3N)
SSRX3_P: U11.28(SSRX3P)
SSRX4_N: U11.35(SSRX4N)
SSRX4_P: U11.34(SSRX4P)
SSRX_N: U10.17(RX_N) U11.53(SSRX0P)
SSRX_P: U10.18(RX_P) U11.52(SSRX0N)
SSTX1_N: C93.1
SSTX1_P: C92.1
SSTX2_N: C97.1
SSTX2_P: C96.1
SSTX3_N: C100.1
SSTX3_P: C98.1
SSTX4_N: C99.1
SSTX4_P: C101.1
SSTX_N: C95.1 U10.21(TXP)
SSTX_P: C94.1 U10.20(TXN)
USBD_N: U11.56(HSD0N)
USBD_P: U11.55(HSD0P)
XIN: C108.1 U11.45(USB3XI) Y3.3(XTAL_P)
XOUT: C107.1 U11.44(USB3XO) Y3.1(XTAL_N)
NetC91_1: C91.1 R30.1 U11.68(RESET#)
NetR28_2: R28.2 U10.24(Current_Setting_in2)
NetR29_2: R29.2 U10.23(Current_Setting_in1)
NetR31_1: R31.1 U11.66(GPIO8/SMCLK)
NetR32_1: R32.1 U11.74(TESTEN)
NetR33_1: R33.1 U11.65(GPIO7/SMDAT)
NetR34_1: R34.1 U10.25(CE)
NetR35_1: R35.1 U11.75(USBOC2)
NetR36_2: R36.2 U10.13(High_Z_CC)
NetR37_2: R37.2 U10.10(REXT)
NetR38_1: R38.1 U11.1(USBOC1)
NetR39_1: R39.1 U11.47(REXT)
NetR40_1: R40.1 R41.2 R42.1
NetR41_1: R41.1 U11.43(VBUSDET0)
NetR43_1: R43.1 U11.41(USBOC0)
NetR44_1: R44.1 U11.40(USBOC4)
NetR45_1: R45.1 U11.20(USBOC3)
NetR46_1: R46.1 U14.3(WP#)
NetR47_2: R47.2 U14.7(HOLD#)

Not connected (* = marked no-connect by the designer): U10 11(Vconn_OC)* 12(Vconn_UVLO)* 14(Current_Setting_out1)* 15(Current_Setting_out2)* 16(Attacned_Status)* 22(ORI_STATUS)*; U11 2(USBPE1)* 21(USBPE3)* 39(USBPE4)* 42(USBPE0)* 57(GPIO0/HID0)* 58(GPIO1/HID1)* 59(GPIO2/HID2)* 60(GPIO3/HID3)* 61(GPIO4/HID4)* 63(GPIO5/WAKE)* 64(GPIO6/USBSUS)* 76(USBPE2)*

### Layout directives
differential pair: cap_SSTX1_N, cap_SSTX1_P, cap_SSTX2_N, cap_SSTX2_P, cap_SSTX3_N, cap_SSTX3_P, cap_SSTX4_N, cap_SSTX4_P, cap_SSTX_N, cap_SSTX_P, HSD1_N, HSD1_P, HSD2_N, HSD2_P, HSD3_N, HSD3_P, HSD4_N, HSD4_P, IN_SSRX1_N, IN_SSRX1_P, IN_SSRX2_N, IN_SSRX2_P, IN_SSTX1_N, IN_SSTX1_P, IN_SSTX2_N, IN_SSTX2_P, SSRX1_N, SSRX1_P, SSRX2_N, SSRX2_P, SSRX3_N, SSRX3_P, SSRX4_N, SSRX4_P, SSRX_N, SSRX_P, SSTX1_N, SSTX1_P, SSTX2_N, SSTX2_P, SSTX3_N, SSTX3_P, SSTX4_N, SSTX4_P, SSTX_N, SSTX_P, USBD_N, USBD_P
net class USB; rule Differential Pairs Routing [Pref Gap = 5mil    Min Gap  = 5mil    Max Gap  = 5milPref Width = 5.1mil    Min Width  = 5.1mil    Max Width  = 5.1mil]; rule Routing Via Style [Pref Size = 0.4mm    Pref Hole Size = 0.3mm]: cap_IN_SSRX1_N, cap_IN_SSRX1_P, cap_IN_SSRX2_N, cap_IN_SSRX2_P, cap_IN_SSTX1_N, cap_IN_SSTX1_P, cap_IN_SSTX2_N, cap_IN_SSTX2_P, cap_SSRX1_N, cap_SSRX1_P, cap_SSRX2_N, cap_SSRX2_P, cap_SSRX3_N, cap_SSRX3_P, cap_SSRX4_N, cap_SSRX4_P, cap_SSTX1_N, cap_SSTX1_P, cap_SSTX2_N, cap_SSTX2_P, cap_SSTX3_N, cap_SSTX3_P, cap_SSTX4_N, cap_SSTX4_P, cap_SSTX_N, cap_SSTX_P, HSD1_N, HSD1_P, HSD2_N, HSD2_P, HSD3_N, HSD3_P, HSD4_N, HSD4_P, IN_CC1, IN_CC2, IN_SSRX1_N, IN_SSRX1_P, IN_SSRX2_N, IN_SSRX2_P, IN_SSTX1_N, IN_SSTX1_P, IN_SSTX2_N, IN_SSTX2_P, SSRX1_N, SSRX1_P, SSRX2_N, SSRX2_P, SSRX3_N, SSRX3_P, SSRX4_N, SSRX4_P, SSRX_N, SSRX_P, SSTX1_N, SSTX1_P, SSTX2_N, SSTX2_P, SSTX3_N, SSTX3_P, SSTX4_N, SSTX4_P, SSTX_N, SSTX_P, USBD_N, USBD_P

### Notes on the sheet
- Labels drawn without touching a wire or pin: cap_IN_SSRX1_N, cap_IN_SSRX1_P, cap_IN_SSRX2_N, cap_IN_SSRX2_P, cap_IN_SSTX1_N, cap_IN_SSTX1_P, cap_IN_SSTX2_N, cap_IN_SSTX2_P, cap_SSRX1_N, cap_SSRX1_P, cap_SSRX2_N, cap_SSRX2_P, cap_SSRX3_N, cap_SSRX3_P, cap_SSRX4_N, cap_SSRX4_P, cap_SSTX1_N, cap_SSTX1_P, cap_SSTX2_N, cap_SSTX2_P, cap_SSTX3_N, cap_SSTX3_P, cap_SSTX4_N, cap_SSTX4_P, cap_SSTX_N, cap_SSTX_P, HSD1_N, HSD1_P, HSD2_N, HSD2_P, HSD3_N, HSD3_P, HSD4_N, HSD4_P, IN_CC1, IN_CC2, IN_SSRX1_N, IN_SSRX1_P, IN_SSRX2_N, IN_SSRX2_P, IN_SSTX1_N, IN_SSTX1_P, IN_SSTX2_N, IN_SSTX2_P, SSRX1_N, SSRX1_P, SSRX2_N, SSRX2_P, SSRX3_N, SSRX3_P, SSRX4_N, SSRX4_P, SSRX_N, SSRX_P, SSTX1_N, SSTX1_P, SSTX2_N, SSTX2_P, SSTX3_N, SSTX3_P, SSTX4_N, SSTX4_P, SSTX_N, SSTX_P, USBD_N, USBD_P

### Library data of the parts
C89-C120 = C: 无极性贴片电容; 版权归属: 源创客; 材质: X7R; BOM名称: 无极性贴片电容; 学习资源: www.ooocke.com
R28-R47 = R: 贴片电阻; 版权归属: 源创客; BOM名称: 贴片电阻; 学习资源: www.ooocke.com
U12 U13 = TPD4E02B04: ESD
U14 = P25D40H
Y3 = Crystal

## Nets that join several sheets
GND: pwr (45 pins), connector (32 pins), jmb575 (58 pins), vl822 (37 pins)
VBUS: pwr (12 pins), connector (6 pins), jmb575 (8 pins), vl822 (7 pins)
VCC1.05V-VL822: pwr (6 pins), vl822 (24 pins)
VCC3.3V-VL822: pwr (6 pins), vl822 (22 pins)
VCC5V-A: pwr (10 pins), connector (J1.P7 J1.P8 J1.P9)
VCC5V-B: pwr (10 pins), connector (J2.P7 J2.P8 J2.P9)
VCC12V: pwr (14 pins), connector (6 pins)
VIN: pwr (5 pins), connector (CON1.1)
GPIO4-B: connector (LED2.2), jmb575 (U6.8)
GPIO4-C: connector (LED4.2), jmb575 (U8.8)
HSD1_N: jmb575 (U8.13), vl822 (U11.10)
HSD1_P: jmb575 (U8.15), vl822 (U11.9)
HSD2_N: connector (J5.2), vl822 (U11.19)
HSD2_P: connector (J5.3), vl822 (U11.18)
HSD3_N: connector (J4.2), vl822 (U11.23)
HSD3_P: connector (J4.3), vl822 (U11.22)
HSD4_N: jmb575 (U6.13), vl822 (U11.38)
HSD4_P: jmb575 (U6.15), vl822 (U11.37)
IN_CC1: connector (J3.A5), vl822 (U10.1)
IN_CC2: connector (J3.B5), vl822 (U10.28)
IN_SSRX1_N: connector (J3.B11), vl822 (U10.7 U12.2 U12.9)
IN_SSRX1_P: connector (J3.B10), vl822 (U10.6 U12.1 U12.10)
IN_SSRX2_N: connector (J3.A11), vl822 (U10.9 U12.5 U12.6)
IN_SSRX2_P: connector (J3.A10), vl822 (U10.8 U12.4 U12.7)
IN_SSTX1_N: connector (J3.A3), vl822 (U10.3 U13.2 U13.9)
IN_SSTX1_P: connector (J3.A2), vl822 (U10.2 U13.1 U13.10)
IN_SSTX2_N: connector (J3.B2), vl822 (U10.4 U13.4 U13.7)
IN_SSTX2_P: connector (J3.B3), vl822 (U10.5 U13.5 U13.6)
RX1_N: connector (C41.2), jmb575 (U8.31)
RX1_P: connector (C43.2), jmb575 (U8.30)
RX2_N: connector (C42.2), jmb575 (U6.31)
RX2_P: connector (C44.2), jmb575 (U6.30)
SSRX1_N: jmb575 (C86.1), vl822 (U11.7)
SSRX1_P: jmb575 (C85.1), vl822 (U11.6)
SSRX2_N: connector (J5.5), vl822 (U11.16)
SSRX2_P: connector (J5.6), vl822 (U11.15)
SSRX3_N: connector (J4.6), vl822 (U11.29)
SSRX3_P: connector (J4.5), vl822 (U11.28)
SSRX4_N: jmb575 (C64.1), vl822 (U11.35)
SSRX4_P: jmb575 (C63.1), vl822 (U11.34)
SSTX1_N: jmb575 (U8.22), vl822 (C93.1)
SSTX1_P: jmb575 (U8.23), vl822 (C92.1)
SSTX2_N: connector (J5.8), vl822 (C97.1)
SSTX2_P: connector (J5.9), vl822 (C96.1)
SSTX3_N: connector (J4.9), vl822 (C100.1)
SSTX3_P: connector (J4.8), vl822 (C98.1)
SSTX4_N: jmb575 (U6.22), vl822 (C99.1)
SSTX4_P: jmb575 (U6.23), vl822 (C101.1)
TX1_N: connector (C39.2), jmb575 (U8.33)
TX1_P: connector (C37.2), jmb575 (U8.34)
TX2_N: connector (C40.2), jmb575 (U6.33)
TX2_P: connector (C38.2), jmb575 (U6.34)
USBD_N: connector (J3.A7 J3.B7), vl822 (U11.56)
USBD_P: connector (J3.A6 J3.B6), vl822 (U11.55)